# EAGLE design M_B_block_base (EAGLE 9.6.2)
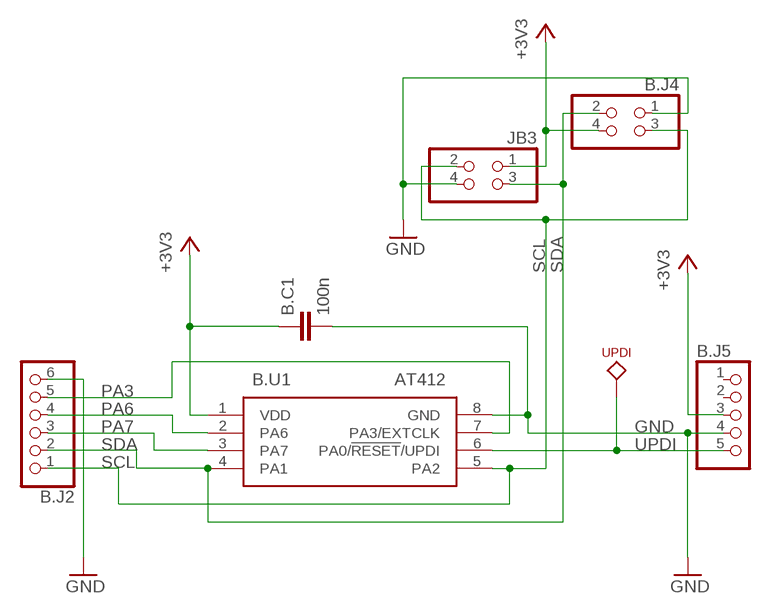
[diagram p0: schematic, sheet 1]

## Parts
B.C1  100n  C-EUC0603  [C0603]
B.J2  PINHD-1X6  [1X06]
B.J4  PINHD-2X2  [2X02]
B.J5  PINHD-1X5  [1X05]
B.U1  AT412  ATTINY412-SSN  [SOIC127P600X175-8N]
JB3  PINHD-2X2  [2X02]
UPDI  TPTP  [TP]

## Nets
3V3: B.C1.1 B.J4.4 B.J5.3 B.U1.1(VDD) JB3.1 ; supply symbol labelled +3V3
GND: B.C1.2 B.J2.6 B.J4.1 B.J5.4 B.U1.8(GND) JB3.4
PA3: B.J2.5 B.U1.7(PA3/EXTCLK)
PA6: B.J2.4 B.U1.2(PA6)
PA7: B.J2.3 B.U1.3(PA7)
SCL: B.J2.1 B.J4.3 B.U1.5(PA2) JB3.2
SDA: B.J2.2 B.J4.2 B.U1.4(PA1) JB3.3
UPDI: B.J5.5 B.U1.6(PA0/!RESET!/UPDI) UPDI.P$1
Unconnected: B.J5.1 B.J5.2

## Library data of the parts
B.C1 = rcl:C-EU: CAPACITOR, European symbol; SPICEPREFIX: C
B.J2 = pinhead2:PINHD-1X6: PIN HEADER
B.J4 JB3 = pinhead2:PINHD-2X2: PIN HEADER
B.J5 = pinhead2:PINHD-1X5: PIN HEADER
B.U1 = ATTINY412-SSN:ATTINY412-SSN: 8-bit Microcontrollers - MCU 20MHz, 4KB, SOIC8, Ind 105C, Green, Tube Source: Datasheet <http://www.microchip.com/mymicrochip/filehandler.aspx?ddocname=en599382>; DESCRIPTION: 8-bit Microcontrollers - MCU 20MHz, 4KB, SOIC8, Ind 105C, Green, Tube; HEIGHT: 1.75mm; MANUFACTURER_NAME: Microchip; MANUFACTURER_PART_NUMBER: ATTINY412-SSN; MOUSER_PART_NUMBER: 579-ATTINY412-SSN; MOUSER_PRICE-STOCK: https://www.mouser.co.uk/ProductDetail/Microchip-Technology/ATTINY412-SSN?qs=3HJ2avRr9PItQG9ZsCamPQ%3D%3D
UPDI = hugo:TP

## Board
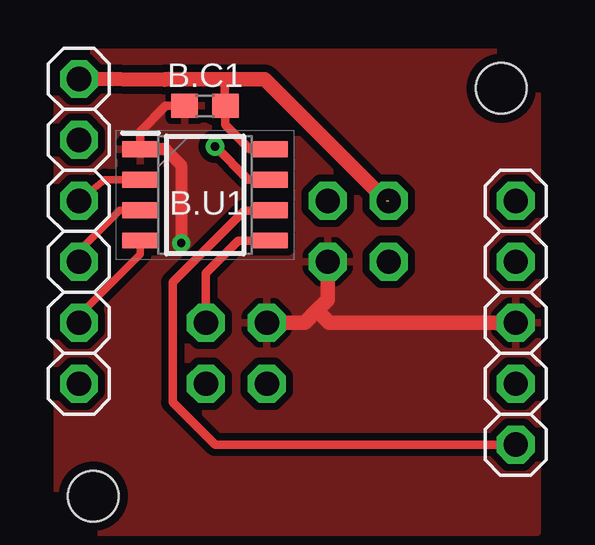
[diagram p1: board, top side]
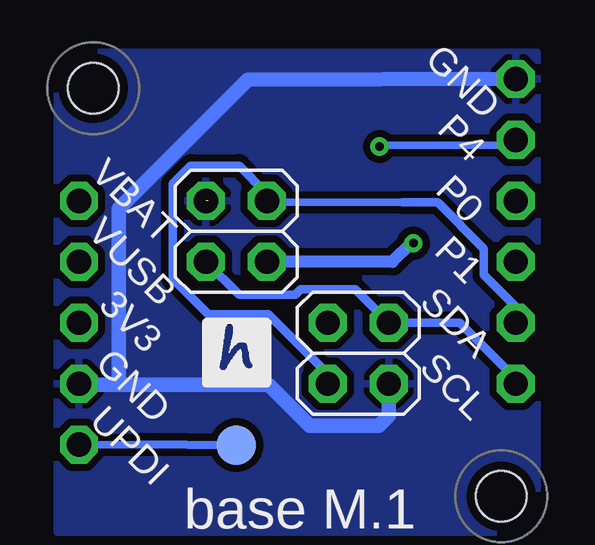
[diagram p2: board, bottom side, seen from below]

No outline drawn. Coordinates in mm, seen from the top.
Copper layers (1*16): Top 0.035mm / dielectric 1.5mm / Bottom 0.035mm
Design rules "default *": minimum track width 10mil, minimum drill 0.35mm, track to track 12mil, track to pad 12mil, pad to pad 12mil, via to via 12mil, smd to smd 12mil, copper to edge 15mil, drill to drill 40mil, minimum pad ring 10mil, minimum via ring 8mil, stop-mask expansion 4mil, vias tented up to drill 0mil, thermal gap 10mil
Holes 2.1 mm at 2,2 19,19

### Footprints (pad centres in the part's own frame; a part is rotated, then mirrored left to right if it is on the bottom)
C0603 = smd 1.1 x 1: 1 -0.85,0; 2 0.85,0
1X06 = drill 1.016 pad 1.575 octagon: 1 -6.35,0; 2 -3.81,0; 3 -1.27,0; 4 1.27,0; 5 3.81,0; 6 6.35,0
2X02 = drill 1.016 pad 1.575 octagon: 1 -1.27,-1.27; 2 -1.27,1.27; 3 1.27,-1.27; 4 1.27,1.27
1X05 = drill 1.016 pad 1.575 octagon: 1 -5.08,0; 2 -2.54,0; 3 0,0; 4 2.54,0; 5 5.08,0
SOIC127P600X175-8N = smd 1.5 x 0.65: 1 -2.7,1.905; 2 -2.7,0.635; 3 -2.7,-0.635; 4 -2.7,-1.905; 5 2.7,-1.905; 6 2.7,-0.635; 7 2.7,0.635; 8 2.7,1.905
TP = smd 1.651 x 1.651: P$1 0,0

### Placement (x,y rotation side)
B.C1  6.65,18.26 0 top
B.J2  1.4,13.04 90 top
B.J4  13.04,13.04 270 bottom
B.J5  19.6,9.23 270 top
B.U1  6.66,14.55 0 top
JB3  7.96,7.96 270 bottom
UPDI  13.04,4.13 0 bottom

### Tracks (layer width: path | path; a pad name or v marks a point on that pad's centre or on a via)
3V3  (via drill 0.35)
  Top 0.356: B.U1.1 3.96,17.2 5.03,18.26 B.C1.1
  Top 0.508: v5.66,12.55 5.66,15.8 5,16.46 B.U1.1
  Top 0.61: 11.32,9.74 11.84,9.22 B.J5.3 | JB3.1 10.8,9.23 11.32,9.74 | B.J4.4 11.77,10.2 11.32,9.74
  Bottom 0.508: v5.66,12.55 5.75,12.55 6.54,11.77 B.J4.4
  Bottom 0.61: B.J5.3
  pour Top (isolate 0.305): 0.5,20.5 0.5,0.5 20.5,0.5 20.5,20.5
GND  (1 unrouted)
  Top 0.356: 9.39,16.43 B.U1.8 8.52,16.46 7.5,17.48 B.C1.2 7.47,18.3 7.47,19.37
  Top 0.61: B.J2.6 4.98,19.35 5,19.37 7.47,19.37 9.15,19.37 14.21,14.31
  Bottom 0.61: B.J2.6 12.56,19.35 17.94,13.98 17.94,6.84 18.14,6.64 | B.J5.4 19.55,6.64 18.14,6.64 | 18.14,6.64 11.69,6.64 9.99,4.94 7.11,4.94 6.68,5.36 JB3.4
  pour Bottom (isolate 0.305): 0.5,20.5 0.5,0.5 20.5,0.5 20.5,20.5
PA3  (via drill 0.35)
  Top 0.356: B.U1.7 8.46,15.19 v7.07,16.57
  Bottom 0.305: v7.07,16.57 7.02,16.62 1.4,16.62 B.J2.5
PA6
  Top 0.305: B.J2.4 2.48,15.19 B.U1.2
PA7
  Top 0.305: B.J2.3 1.4,11.73 1.4,12.21 3.1,13.91 3.62,13.91 3.63,13.92 B.U1.3
SCL
  Top 0.356: B.U1.5 8.04,12.65 6.68,11.29 JB3.2
  Bottom 0.356: B.J2.1 1.4,6.9 3.73,9.23 JB3.2 8.08,10.62 10.36,10.62 10.59,10.39 12.93,10.39 B.J4.3
SDA
  Top 0.305: B.J2.2 1.4,9.52 3.96,12.08 B.U1.4
  Bottom 0.305: 11.51,14.25 6.13,14.25
  Bottom 0.356: 11.51,14.25 11.71,14.25 B.J4.2 11.77,14.62 12.93,15.77 14.94,15.77 15.7,15.01 15.7,11.07 14.22,9.59 11.72,9.59 9.23,7.1 JB3.3 | 6.13,14.25 4.65,14.25 2.72,12.32 2.72,11.22 1.4,9.9 B.J2.2
UPDI
  Top 0.356: B.U1.6 9.33,13.89 8.28,13.89 5.31,10.91 5.31,5.92 7.08,4.15 B.J5.5
  Bottom 0.305: B.J5.5 17,4.15 UPDI.P$1
  Bottom 0.356: UPDI.P$1 17.14,4.17

### Text on the board
bPlace: GND | P4 | P0 | VBAT | P1 | VUSB | SDA | 3V3 | SCL | GND | UPDI | base M.1